# Altium schematic sheet 7e - VBATT Stepdown.SchDoc
size A4
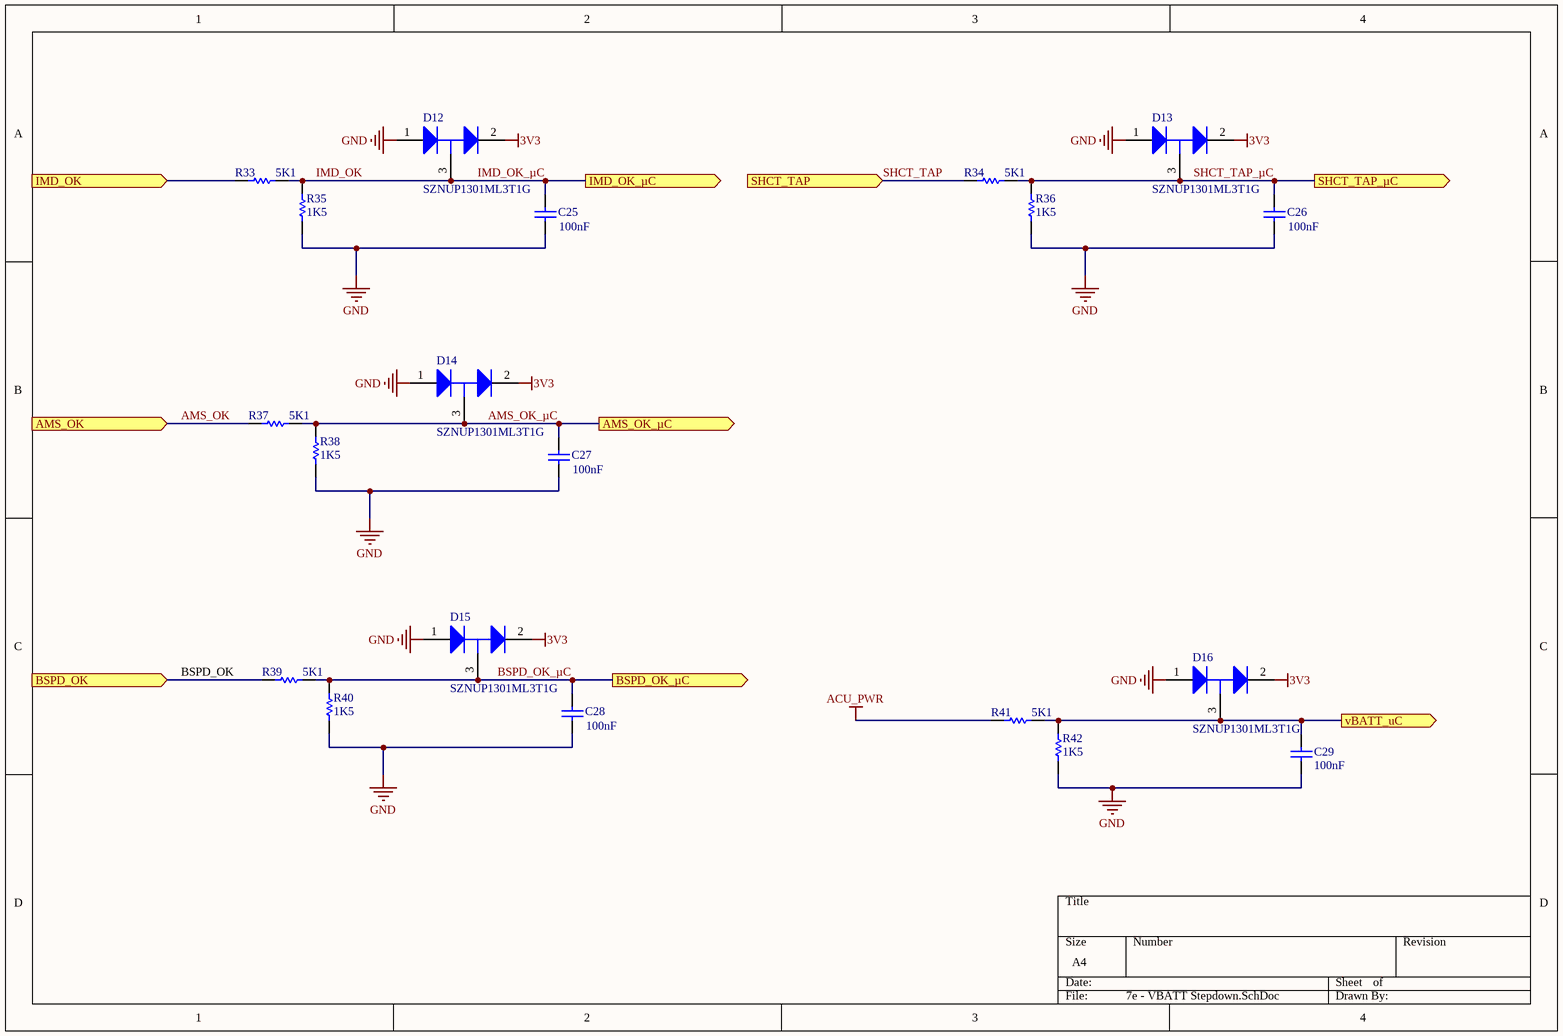
[diagram p0: 7e - VBATT Stepdown.SchDoc]

## Parts
C25  value 100nF  [1608[0603]]  (hidden comment: Cap)
C26  value 100nF  [1608[0603]]  (hidden comment: Cap)
C27  value 100nF  [1608[0603]]  (hidden comment: Cap)
C28  value 100nF  [1608[0603]]  (hidden comment: Cap)
C29  value 100nF  [1608[0603]]  (hidden comment: Cap)
D12  SZNUP1301ML3T1G  [ONSC-SOT-23-3-318-08_V]
D13  SZNUP1301ML3T1G  [ONSC-SOT-23-3-318-08_V]
D14  SZNUP1301ML3T1G  [ONSC-SOT-23-3-318-08_V]
D15  SZNUP1301ML3T1G  [ONSC-SOT-23-3-318-08_V]
D16  SZNUP1301ML3T1G  [ONSC-SOT-23-3-318-08_V]
R33  value 5K1  [1608[0603]]  (hidden comment: Res1)
R34  value 5K1  [1608[0603]]  (hidden comment: Res1)
R35  value 1K5  [1608[0603]]  (hidden comment: Res1)
R36  value 1K5  [1608[0603]]  (hidden comment: Res1)
R37  value 5K1  [1608[0603]]  (hidden comment: Res1)
R38  value 1K5  [1608[0603]]  (hidden comment: Res1)
R39  value 5K1  [1608[0603]]  (hidden comment: Res1)
R40  value 1K5  [1608[0603]]  (hidden comment: Res1)
R41  value 5K1  [1608[0603]]  (hidden comment: Res1)
R42  value 1K5  [1608[0603]]  (hidden comment: Res1)

## Ports
AMS_OK (in), AMS_OK_µC (out), BSPD_OK (in), BSPD_OK_µC (out), IMD_OK (in), IMD_OK_µC (out), SHCT_TAP (in), SHCT_TAP_µC (out), vBATT_uC (out)

## Nets
3V3: D12.2(K) D13.2(K) D14.2(K) D15.2(K) D16.2(K)
ACU_PWR: R41.1
GND: C25.1 C26.1 C27.1 C28.1 C29.1 D12.1(A) D13.1(A) D14.1(A) D15.1(A) D16.1(A) R35.1 R36.1 R38.1 R40.1 R42.1
AMS_OK: R37.1 ; port AMS_OK
AMS_OK_µC: C27.2 D14.3(K/A) R37.2 R38.2 ; port AMS_OK_µC
BSPD_OK: R39.1 ; port BSPD_OK
BSPD_OK_µC: C28.2 D15.3(K/A) R39.2 R40.2 ; port BSPD_OK_µC
IMD_OK: C25.2 D12.3(K/A) R33.2 R35.2 ; port IMD_OK_µC  [also labelled IMD_OK_µC]
IMD_OK: R33.1 ; port IMD_OK  [a separate net that carries the same name]
SHCT_TAP: R34.1 ; port SHCT_TAP
SHCT_TAP_µC: C26.2 D13.3(K/A) R34.2 R36.2 ; port SHCT_TAP_µC
vBATT_uC: C29.2 D16.3(K/A) R41.2 R42.2 ; port vBATT_uC

## Library data of the parts
C25-C29 = Cap: Capacitor; Published: 8-Jun-2000; LatestRevisionDate: 17-Jul-2002; LatestRevisionNote: Re-released for DXP Platform.; PackageReference: RAD-0.3; Publisher: Altium Limited; PackageDescription: Radial Cap, Thru-Hole; 2 Leads; 0.3 in Pin Spacing
D12-D16 = CMP-1063-00171-1: Low Capacitance Diode Array for ESD Protection in a Single Data Line, 3-Pin SOT-23, Pb-Free, Tape and Reel; Manufacturer: On Semiconductor; C Max (pF): 0.9; Direction: Bidirectional; V(BR) Min (V): 70; Number of Lines: 1; Mounting Technology: Surface Mount; PackageReference: SOT-23-3-318-08; DatasheetVersion: Rev. 6; PackageVersion: Rev. AP, 11/2009; RoHS: Pb-Free; ComponentLink1Description: Manufacturer URL; ComponentLink1URL: http://www.onsemi.com/; PackageDescription: 3-Pin Small Outline Transistor, Body 2.92 x 1.3 mm, Pitch 0.95 mm; PartNumber: SZNUP1301ML3T1G; Packing: Tape and Reel; ComponentLink3URL: http://www.onsemi.cn/pub_link/Collateral/318-08.PDF; ComponentLink3Description: Package Specification; VRWM Max (V): 70; ComponentLink2Description: Datasheet; ComponentLink2URL: http://www.onsemi.cn/pub_link/Collateral/NUP1301ML3T1-D.PDF
R33-R42 = Res1: Resistor; Published: 8-Jun-2000; LatestRevisionDate: 17-Jul-2002; LatestRevisionNote: Re-released for DXP Platform.; PackageReference: AXIAL-0.3; Publisher: Altium Limited; PackageDescription: Axial Device, Thru-Hole; 2 Leads; 0.3 in Pin Spacing